# EAGLE schematic UpTo11.FrontPanel (EAGLE 7.6.0)
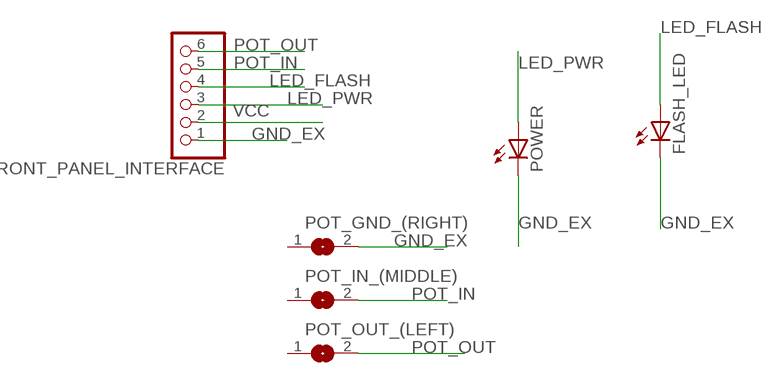
[diagram p0: schematic, sheet 1]

## Parts
FLASH_LED  LED5MM  [LED5MM]
FRONT_PANEL_INTERFACE  PINHD-1X6  [1X06]
POT_GND_(RIGHT)  SOLDERJUMPERREFLOW  [SOLDERJUMPER_REFLOW]
POT_IN_(MIDDLE)  SOLDERJUMPERREFLOW  [SOLDERJUMPER_REFLOW]
POT_OUT_(LEFT)  SOLDERJUMPERREFLOW  [SOLDERJUMPER_REFLOW]
POWER  LEDSMT1206  [1206]

## Nets
GND_EX: FLASH_LED.K(C) FRONT_PANEL_INTERFACE.1 POT_GND_(RIGHT).2 POWER.C
LED_FLASH: FLASH_LED.A FRONT_PANEL_INTERFACE.4
LED_PWR: FRONT_PANEL_INTERFACE.3 POWER.A
POT_IN: FRONT_PANEL_INTERFACE.5 POT_IN_(MIDDLE).2
POT_OUT: FRONT_PANEL_INTERFACE.6 POT_OUT_(LEFT).2
VCC: FRONT_PANEL_INTERFACE.2
Unconnected: POT_GND_(RIGHT).1 POT_IN_(MIDDLE).1 POT_OUT_(LEFT).1

## Library data of the parts
FLASH_LED POWER = adafruit:LED: LED OSRAM: - CHIPLED LG R971, LG N971, LY N971, LG Q971, LY Q971, LO R971, LY R971 LH N974, LH R974 LS Q976, LO Q976, LY Q976 LO Q996 - Hyper CHIPLED LW Q18S LB Q993, LB Q99A, LB R99A - SideLED LS A670, LO A670, LY A670, LG A670, LP A670 LB A673, LV A673, LT A673, LW A673 LH A674 LY A675 LS A676, LA A676, LO A676, LY A676, LW A676 LS A679, LY A679, LG A679 - Hyper Micro SIDELED® LS Y876, LA Y876, LO Y876, LY Y876 LT Y87S - SmartLED LW L88C, LW L88S LB L89C, LB L89S, LG L890 LS L89K, LO L89K, LY L89K LS L896, LA L896, LO L896, LY L896 - TOPLED LS T670, LO T670, LY T670, LG T670, LP T670 LSG T670, LSP T670, LSY T670, LOP T670, LYG T670 LG T671, LOG T671, LSG T671 LB T673, LV T673, LT T673, LW T673 LH T674 LS T676, LA T676, LO T676, LY T676, LB T676, LH T676, LSB T676, LW T676 LB T67C, LV T67C, LT T67C, LS T67K, LO T67K, LY T67K, LW E67C LS E67B, LA E67B, LO E67B, LY E67B, LB E67C, LV E67C, LT E67C LW T67C LS T679, LY T679, LG T679 LS T770, LO T770, LY T770, LG T770, LP T770 LB T773, LV T773, LT T773, LW T773 LH T774 LS E675, LA E675, LY E675, LS T675 LS T776, LA T776, LO T776, LY T776, LB T776 LHGB T686 LT T68C, LB T68C - Hyper Mini TOPLED® LB M676 - Mini TOPLED Santana® LG M470 LS M47K, LO M47K, LY M47K Source: http://www.osram.convergy.de/
FRONT_PANEL_INTERFACE = adafruit:PINHD-1X6: PIN HEADER
POT_GND_(RIGHT) POT_IN_(MIDDLE) POT_OUT_(LEFT) = microbuilder:SOLDERJUMPER: SMD Solder JUMPER Solder the two pads together to create a connection, or remove the solder to break it. REFLOW - Use this footprint for solder paste and reflow ovens. WAVE - Use this footprint for hand-soldering (larger pads). CLOSED - Has a trace between the two pads to ensure it is closed by default. The trace needs to be cut to disable the jumper, and can be closed again by creating a solder bridge between the two pads.

## Net classes
0 default: clearance 0.205 mm